# Altium schematic sheet Main.SchDoc: Smart Watch Final Project
size A4; Author: Mohamat Eirban Ali; CompanyName: University of Oklahoma; Organization: University of Oklahoma; Address1: E 41st St, Tulsa; Address2: OK 74135; Address3: USA; DocumentNumber: 1; Revision: 1; SheetNumber: 1; SheetTotal: 1
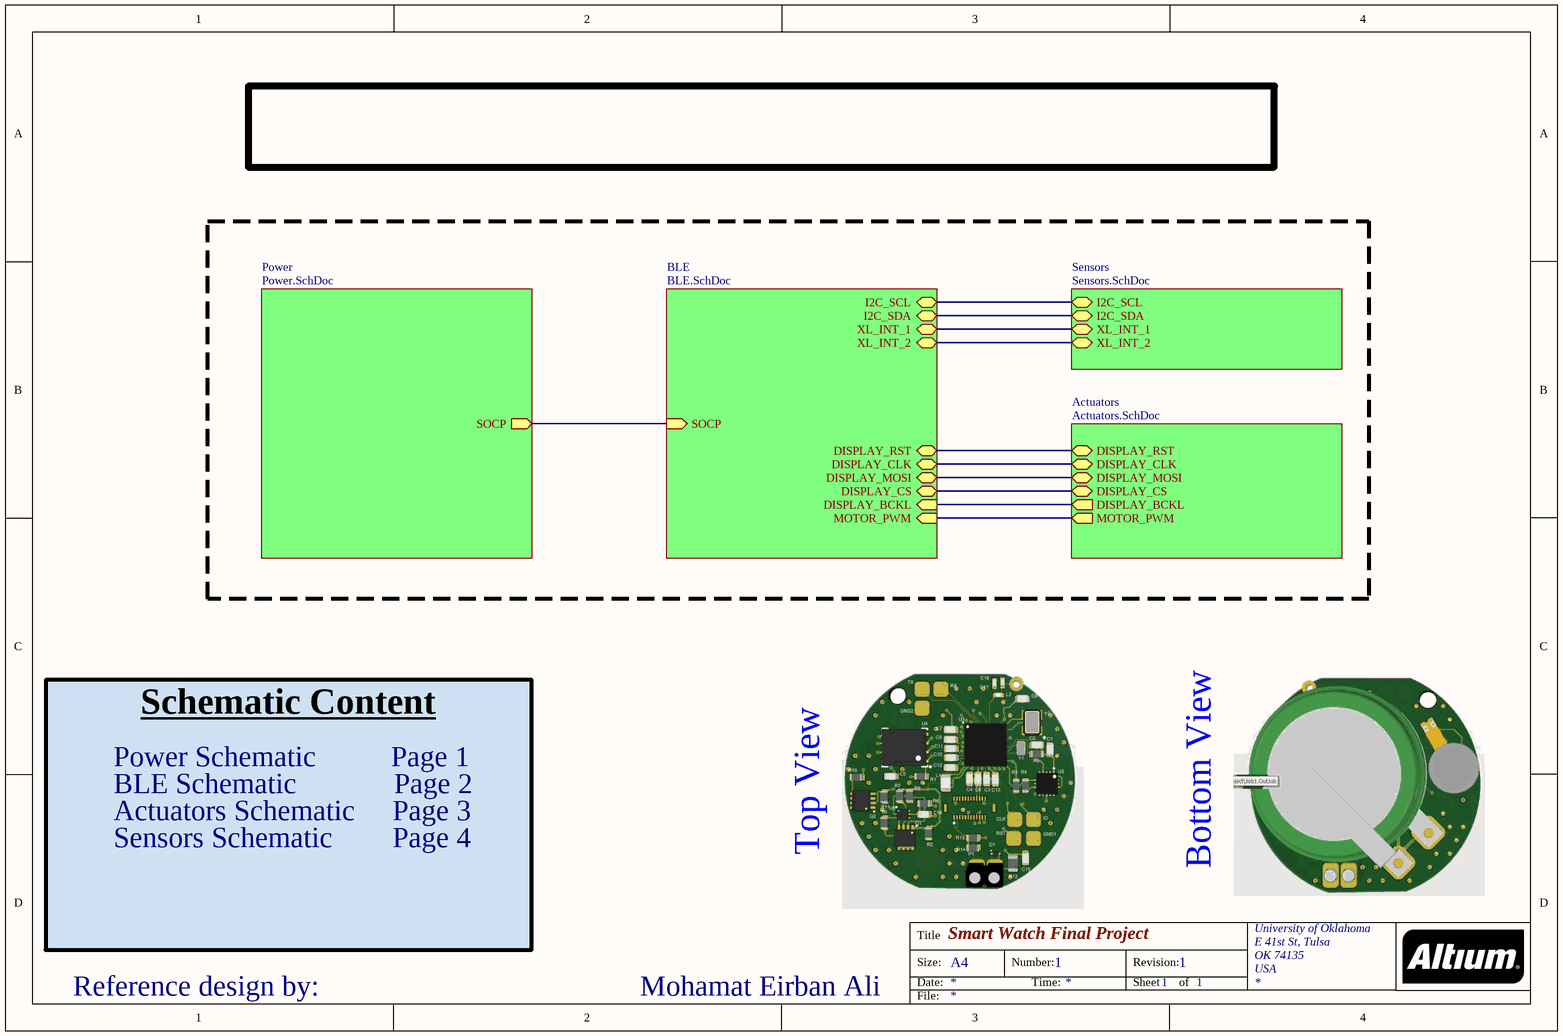
[diagram p0: Main.SchDoc]

## Sub-sheets
Actuators = Actuators.SchDoc: DISPLAY_RST (bidir), DISPLAY_CLK (bidir), DISPLAY_MOSI (bidir), DISPLAY_CS (bidir), DISPLAY_BCKL (out), MOTOR_PWM (out)
BLE = BLE.SchDoc: SOCP (in), I2C_SCL (bidir), I2C_SDA (bidir), XL_INT_1 (bidir), XL_INT_2 (bidir), DISPLAY_RST (bidir), DISPLAY_CLK (bidir), DISPLAY_MOSI (bidir), DISPLAY_CS (bidir), DISPLAY_BCKL (in), MOTOR_PWM (in)
Power = Power.SchDoc: SOCP (out)
Sensors = Sensors.SchDoc: I2C_SCL (bidir), I2C_SDA (bidir), XL_INT_1 (bidir), XL_INT_2 (bidir)

## Nets
(unnamed): sheet Power/SOCP, sheet BLE/SOCP
(unnamed): sheet BLE/I2C_SCL, sheet Sensors/I2C_SCL
(unnamed): sheet BLE/I2C_SDA, sheet Sensors/I2C_SDA
(unnamed): sheet BLE/XL_INT_1, sheet Sensors/XL_INT_1
(unnamed): sheet BLE/XL_INT_2, sheet Sensors/XL_INT_2
(unnamed): sheet BLE/DISPLAY_RST, sheet Actuators/DISPLAY_RST
(unnamed): sheet BLE/DISPLAY_CLK, sheet Actuators/DISPLAY_CLK
(unnamed): sheet BLE/DISPLAY_MOSI, sheet Actuators/DISPLAY_MOSI
(unnamed): sheet BLE/DISPLAY_CS, sheet Actuators/DISPLAY_CS
(unnamed): sheet BLE/DISPLAY_BCKL, sheet Actuators/DISPLAY_BCKL
(unnamed): sheet BLE/MOTOR_PWM, sheet Actuators/MOTOR_PWM

## Notes on the sheet
- Power Schematic          Page 1
- BLE Schematic             Page 2
- Actuators Schematic     Page 3
- Sensors Schematic        Page 4
- Top View
- Bottom View
- Schematic Content
- Reference design by:
- Title
- Size:
- Date:
- A4
- Number:
- Time:
- Revision:
- Sheet
- of
- File: